# EAGLE design ETAG_v9.3b_EM4095 (EAGLE 7.5.0)

## Sheet 1 of 2
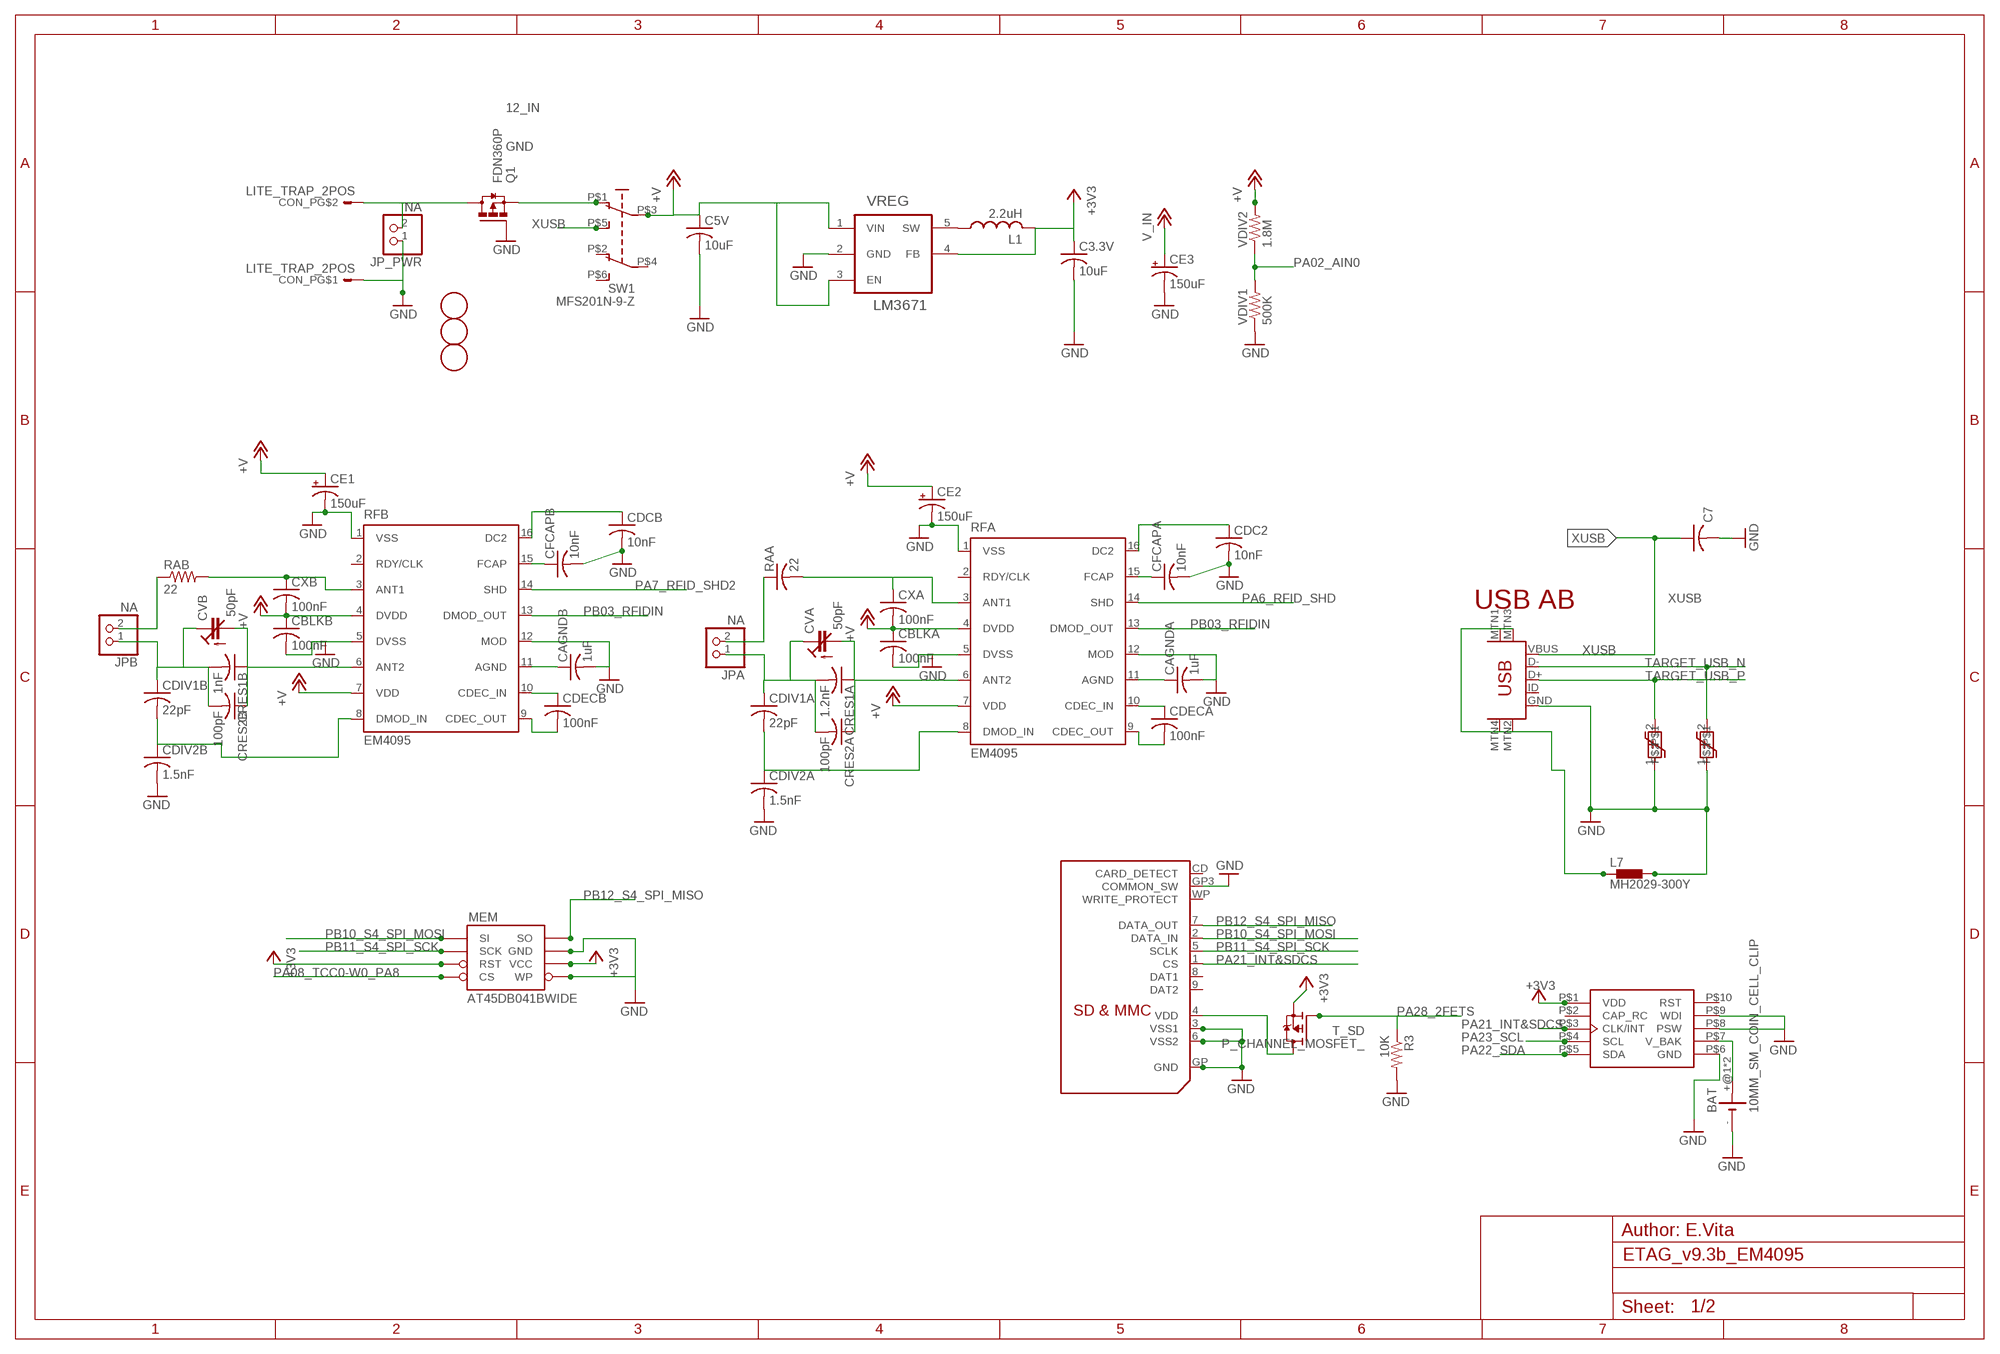
[diagram p0: schematic, sheet 1]

### Parts
BAT  10MM_SM_COIN_CELL_CLIP  [10MM_SM_COIN_CELL_CLIP]
C3.3V  10uF  C-USC0805  [C0805]
C5V  10uF  C-USC0805  [C0805]
C7  10nF  C-USROUND  [C0603-ROUND]
CAGNDA  1uF  C-US  [C0603-ROUND]
CAGNDB  1uF  C-US  [C0603-ROUND]
CBLKA  100nF  C-US  [C0603-ROUND]
CBLKB  100nF  C-US  [C0603-ROUND]
CDC2  10nF  C-US  [C0603-ROUND]
CDCB  10nF  C-USROUND  [C0603-ROUND]
CDECA  100nF  C-US  [C0603-ROUND]
CDECB  100nF  C-US  [C0603-ROUND]
CDIV1A  22pF  C-US  [C0603-ROUND]
CDIV1B  22pF  C-US  [C0603-ROUND]
CDIV2A  1.5nF  C-USROUND  [C0603-ROUND]
CDIV2B  1.5nF  C-US  [C0603-ROUND]
CE1  150uF  CPOL-USE2-5  [E2-5]
CE2  150uF  CPOL-USE2-5  [E2-5]
CE3  150uF  CPOL-USE2-5  [E2-5]
CFCAPA  10nF  C-USROUND  [C0603-ROUND]
CFCAPB  10nF  C-US  [C0603-ROUND]
CON_P  LITE_TRAP_2POS  [LITE_TRAP_MINI]
CRES1A  1.2nF  C-USROUND  [C0603-ROUND]
CRES1B  1nF  C-US  [C0603-ROUND]
CRES2A  100pF  C-US  [C0603-ROUND]
CRES2B  100pF  C-US  [C0603-ROUND]
CVA  50pF  C-TRIMM3018_11  [CTRIM3018_11]
CVB  50pF  C-TRIMM3018_11  [CTRIM3018_11]
CXA  100nF  C-US  [C0603-ROUND]
CXB  100nF  C-US  [C0603-ROUND]
FD1  FIDUCIALMOUNT  [FIDUCIA-MOUNT]
FD2  FIDUCIALMOUNT  [FIDUCIA-MOUNT]
FD3  FIDUCIALMOUNT  [FIDUCIA-MOUNT]
JP_PWR  NA  PINHD-1X2  [1X02]
JPA  NA  PINHD-1X2  [1X02]
JPB  NA  PINHD-1X2  [1X02]
L1  2.2uH  L-US4X4  [SMT_COIL_INDUCTOR_4X4MM]
L7  MH2029-300Y  BLM15H0805  [C0805K]
MEM  AT45DB041BWIDE  [SO08WIDE]
Q1  FDN360P  [SUPER-SOT3]
R3  10K  R-US_ROUND  [C0603-ROUND]
RAA  22  C-USC0805  [C0805]
RAB  22  R-US_R0805  [R0805]
RFA  EM4095  [SO16]
RFB  EM4095  [SO16]
RTC  MC-RTC-RV-1805-C3-I2C  [MC-RTC-C3]
SD  SDMMC06132  [06132]
SW1  MFS201N-9-Z  [MFS201N-9-Z]
T_SD  P_CHANNEL_MOSFET_  [SOT23]
USB  USB-MINIB-5PIN  [USB-MINIB]
VDIV1  500K  R-US_ROUND  [C0603-ROUND]
VDIV2  1.8M  R-US_ROUND  [C0603-ROUND]
VREG  LM3671  LM3671_SWITCHING_REGSOT23  [SOT23-5L]
Z5  ESD_SUPRESSOR  [C0603-ROUND]
Z6  ESD_SUPRESSOR  [C0603-ROUND]

### Nets
2GND [gnd]: L7.1 USB.MTN1(MTN2) USB.MTN2(MTN3) USB.MTN3(MTN1) USB.MTN4
12_IN: CON_P.P$3 CON_P.P$4 JP_PWR.2 Q1.3(D)
+3V3: C3.3V.1 L1.P$2 MEM.3(RST) MEM.6(VCC) RTC.P$1(VDD) T_SD.2(S) VREG.4(FB) ; also sheet 2
CVB: CDIV1B.1 CRES1B.2 CRES2B.2 CVB.+(E) JPB.1
GND [gnd]: BAT.- C3.3V.2 C5V.2 C7.2 CAGNDA.2 CAGNDB.2 CBLKA.2 CBLKB.2 CDC2.2 CDCB.2 CDIV2A.2 CDIV2B.2 CE1.- CE2.- CE3.- CFCAPA.2 CFCAPB.2 CON_P.P$1 CON_P.P$2 JP_PWR.1 L7.2 MEM.5(WP) MEM.7(GND) Q1.1(G) R3.2 RFA.1(VSS) RFA.5(DVSS) RFA.12(MOD) RFB.1(VSS) RFB.5(DVSS) RFB.12(MOD) RTC.P$6(GND) RTC.P$8(PSW) RTC.P$9(WDI) SD.3(VSS1) SD.6(VSS2) SD.GP3(COMMON_SW) SD.GP(GND) USB.GND VDIV1.1 VREG.2(GND) Z5.1 Z6.1 ; also sheet 2
N$2: CFCAPB.1 RFB.15(FCAP)
N$3: CAGNDB.1 RFB.11(AGND)
N$4: CFCAPA.1 RFA.15(FCAP)
N$5: CAGNDA.1 RFA.11(AGND)
N$6: CDC2.1 RFA.16(DC2)
N$7: CRES1B.1 CRES2B.1 CVB.-(A) RFB.6(ANT2)
N$8: CDIV1B.2 CDIV2B.1 RFB.8(DMOD_IN)
N$9: CDCB.1 RFB.16(DC2)
N$11: CDECB.2 RFB.9(CDEC_OUT)
N$12: CRES1A.1 CRES2A.1 CVA.-(A) RFA.6(ANT2)
N$13: CDIV1A.2 CDIV2A.1 RFA.8(DMOD_IN)
N$14: CDIV1A.1 CRES1A.2 CRES2A.2 CVA.+(E) JPA.1
N$15: CDECB.1 RFB.10(CDEC_IN)
N$16: CXB.1 RAB.2 RFB.3(ANT1)
N$17: Q1.2(S) SW1.P$1(O)
N$18: CDECA.2 RFA.9(CDEC_OUT)
N$19: CDECA.1 RFA.10(CDEC_IN)
N$20: CXA.1 RAA.2 RFA.3(ANT1)
N$22: JPB.2 RAB.1
N$35: JPA.2 RAA.1
PA02_AIN0: VDIV1.2 VDIV2.1 ; also sheet 2
PA6_RFID_SHD: RFA.14(SHD) ; also sheet 2
PA7_RFID_SHD2: RFB.14(SHD) ; also sheet 2
PA08_TCC0-W0_PA8: MEM.4(CS) ; also sheet 2
PA21_INT&SDCS: RTC.P$3(CLK/INT) SD.1(CS) ; also sheet 2
PA22_SDA: RTC.P$5(SDA) ; also sheet 2
PA23_SCL: RTC.P$4(SCL) ; also sheet 2
PA28_2FETS: R3.1 T_SD.1(G) ; also sheet 2
PB03_RFIDIN: RFA.13(DMOD_OUT) RFB.13(DMOD_OUT) ; also sheet 2
PB10_S4_SPI_MOSI: MEM.1(SI) SD.2(DATA_IN) ; also sheet 2
PB11_S4_SPI_SCK: MEM.2(SCK) SD.5(SCLK) ; also sheet 2
PB12_S4_SPI_MISO: MEM.8(SO) SD.7(DATA_OUT) ; also sheet 2
SW: L1.P$1 VREG.5(SW)
TARGET_USB_N [USBpair]: USB.D- Z6.2 ; also sheet 2
TARGET_USB_P [USBpair]: USB.D+ Z5.2 ; also sheet 2
V_IN: C5V.1 CBLKA.1 CBLKB.1 CE1.+ CE2.+ CE3.+ CXA.2 CXB.2 RFA.4(DVDD) RFA.7(VDD) RFB.4(DVDD) RFB.7(VDD) SW1.P$3(P) VDIV2.2 VREG.1(VIN) VREG.3(EN) ; supply symbol labelled +V ; also sheet 2
VBAT1: BAT.+@1(+) BAT.+@2(+) RTC.P$7(V_BAK)
VDD: SD.4(VDD) T_SD.3(D)
XUSB [usbvcc]: C7.1 SW1.P$5(S) USB.VBUS
Unconnected: RFA.2(RDY/CLK) RFB.2(RDY/CLK) RTC.P$2(CAP_RC) RTC.P$10(RST) SD.8(DAT1) SD.9(DAT2) SD.CD(CARD_DETECT) SD.WP(WRITE_PROTECT) SW1.P$2(O1) SW1.P$4(P1) SW1.P$6(S1) USB.ID

### Notes on the sheet
- USB AB
- Author: E.Vita

## Sheet 2 of 2
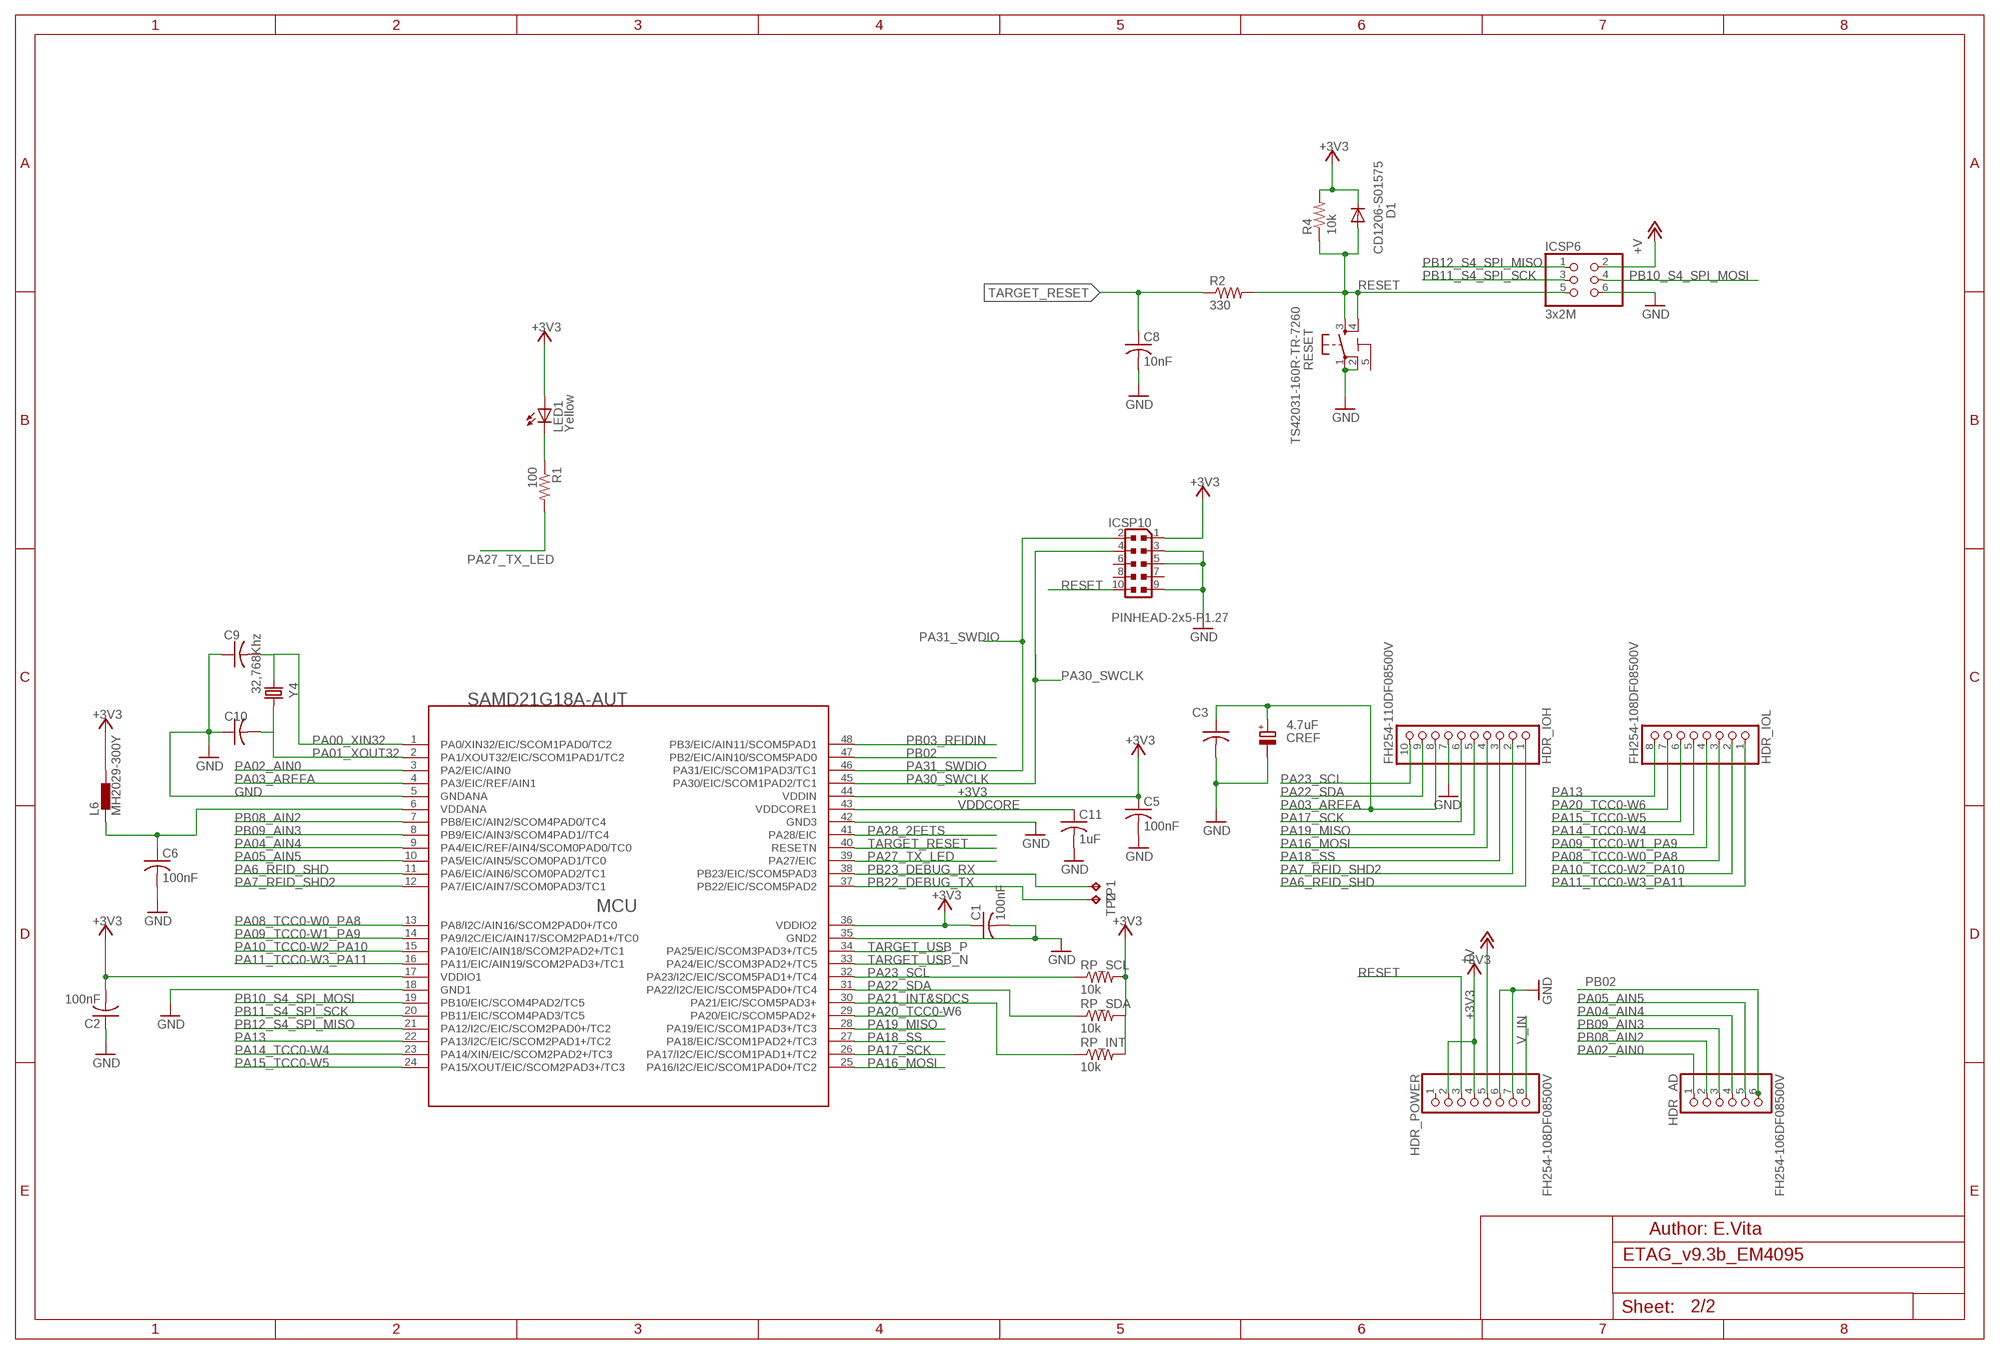
[diagram p1: schematic, sheet 2]

### Parts
C1  100nF  C-USROUND  [C0603-ROUND]
C2  100nF  C-USROUND  [C0603-ROUND]
C3  100nF  C-USROUND  [C0603-ROUND]
C5  100nF  C-USROUND  [C0603-ROUND]
C6  100nF  C-USROUND  [C0603-ROUND]
C8  10nF  C-USROUND  [C0603-ROUND]
C9  22pF  C-USROUND  [C0603-ROUND]
C10  22pF  C-USROUND  [C0603-ROUND]
C11  1uF  C-USROUND  [C0603-ROUND]
CREF  4.7uF  0474_TAJA475M016RNJ  [SMC_A]
D1  CD1206-S01575  0012_CD1206-S01575  [MINIMELF]
HDR_AD  FH254-106DF08500V  1682_20TW-535_STD  [1X06]
HDR_IOH  FH254-110DF08500V  1684_20TW-537  [1X10]
HDR_IOL  FH254-108DF08500V  1683_20TW-536  [1X08]
HDR_POWER  FH254-108DF08500V  1683_20TW-536  [1X08]
ICSP6  3x2M  0114_PH254-203DF118A00V  [2X03]
ICSP10  PINHEAD-2x5-P1.27  0171_PH127-205DF055G00AROUND-PADS  [PINHEAD_2X05_127]
L6  MH2029-300Y  BLM15H0805  [C0805K]
LED1  Yellow  0044_KPT-2012YC  [CHIPLED_0805]
MCU  SAMD21G18A-AUT  1792_SAMD21G18A-AUT  [TQFP48-7X7]
R1  100  R-US_ROUND  [C0603-ROUND]
R2  330  R-US_ROUND  [C0603-ROUND]
R4  10k  R-US_ROUND  [C0603-ROUND]
RESET  TS42031-160R-TR-7260  0946_TS42031-160W-TR-7260  [TS42]
RP_INT  10k  R-US_ROUND  [C0603-ROUND]
RP_SCL  10k  R-US_ROUND  [C0603-ROUND]
RP_SDA  10k  R-US_ROUND  [C0603-ROUND]
TP1  TPTP15R  [TP15R]
TP2  TPTP15R  [TP15R]
Y4  32,768Khz  0213_ABS07-32.768KHZ-T  [RESONATOR_EPSON_FC_145]

### Nets
+3V3: C1.1 C2.2 C5.1 D1.C HDR_POWER.2 HDR_POWER.4 ICSP10.1 L6.2 LED1.A MCU.17(VDDIO1) MCU.36(VDDIO2) MCU.44(VDDIN) R4.2 RP_INT.2 RP_SCL.2 RP_SDA.2 ; also sheet 1
GND [gnd]: C1.2 C2.1 C3.2 C5.2 C6.2 C8.2 C9.1 C10.1 C11.2 CREF.- HDR_IOH.7 HDR_POWER.6 HDR_POWER.7 ICSP6.6 ICSP10.3 ICSP10.5 ICSP10.9 MCU.5(GNDANA) MCU.18(GND1) MCU.35(GND2) MCU.42(GND3) RESET.1 RESET.2 ; also sheet 1
N$1: LED1.C R1.1
N$10: C6.1 L6.1 MCU.6(VDDANA)
PA00_XIN32: C9.2 MCU.1(PA0/XIN32/EIC/SCOM1PAD0/TC2) Y4.P$1
PA01_XOUT32: C10.2 MCU.2(PA1/XOUT32/EIC/SCOM1PAD1/TC2) Y4.P$2
PA02_AIN0: HDR_AD.1 MCU.3(PA2/EIC/AIN0) ; also sheet 1
PA03_AREFA: C3.1 CREF.+ HDR_IOH.8 MCU.4(PA3/EIC/REF/AIN1)
PA04_AIN4: HDR_AD.4 MCU.9(PA4/EIC/REF/AIN4/SCOM0PAD0/TC0)
PA05_AIN5: HDR_AD.5 MCU.10(PA5/EIC/AIN5/SCOM0PAD1/TC0)
PA6_RFID_SHD: HDR_IOH.1 MCU.11(PA6/EIC/AIN6/SCOM0PAD2/TC1) ; also sheet 1
PA7_RFID_SHD2: HDR_IOH.2 MCU.12(PA7/EIC/AIN7/SCOM0PAD3/TC1) ; also sheet 1
PA08_TCC0-W0_PA8: HDR_IOL.3 MCU.13(PA8/I2C/AIN16/SCOM2PAD0+/TC0) ; also sheet 1
PA09_TCC0-W1_PA9: HDR_IOL.4 MCU.14(PA9/I2C/EIC/AIN17/SCOM2PAD1+/TC0)
PA10_TCC0-W2_PA10: HDR_IOL.2 MCU.15(PA10/EIC/AIN18/SCOM2PAD2+/TC1)
PA11_TCC0-W3_PA11: HDR_IOL.1 MCU.16(PA11/EIC/AIN19/SCOM2PAD3+/TC1)
PA13: HDR_IOL.8 MCU.22(PA13/I2C/EIC/SCOM2PAD1+/TC2)
PA14_TCC0-W4: HDR_IOL.5 MCU.23(PA14/XIN/EIC/SCOM2PAD2+/TC3)
PA15_TCC0-W5: HDR_IOL.6 MCU.24(PA15/XOUT/EIC/SCOM2PAD3+/TC3)
PA16_MOSI: HDR_IOH.4 MCU.25(PA16/I2C/EIC/SCOM1PAD0+/TC2)
PA17_SCK: HDR_IOH.6 MCU.26(PA17/I2C/EIC/SCOM1PAD1+/TC2)
PA18_SS: HDR_IOH.3 MCU.27(PA18/EIC/SCOM1PAD2+/TC3)
PA19_MISO: HDR_IOH.5 MCU.28(PA19/EIC/SCOM1PAD3+/TC3)
PA20_TCC0-W6: HDR_IOL.7 MCU.29(PA20/EIC/SCOM5PAD2+)
PA21_INT&SDCS: MCU.30(PA21/EIC/SCOM5PAD3+) RP_INT.1 ; also sheet 1
PA22_SDA: HDR_IOH.9 MCU.31(PA22/I2C/EIC/SCOM5PAD0+/TC4) RP_SDA.1 ; also sheet 1
PA23_SCL: HDR_IOH.10 MCU.32(PA23/I2C/EIC/SCOM5PAD1+/TC4) RP_SCL.1 ; also sheet 1
PA27_TX_LED: MCU.39(PA27/EIC) R1.2
PA28_2FETS: MCU.41(PA28/EIC) ; also sheet 1
PA30_SWCLK: ICSP10.4 MCU.45(PA30/EIC/SCOM1PAD2/TC1)
PA31_SWDIO: ICSP10.2 MCU.46(PA31/EIC/SCOM1PAD3/TC1)
PB02: HDR_AD.6 MCU.47(PB2/EIC/AIN10/SCOM5PAD0)
PB03_RFIDIN: MCU.48(PB3/EIC/AIN11/SCOM5PAD1) ; also sheet 1
PB08_AIN2: HDR_AD.2 MCU.7(PB8/EIC/AIN2/SCOM4PAD0/TC4)
PB09_AIN3: HDR_AD.3 MCU.8(PB9/EIC/AIN3/SCOM4PAD1//TC4)
PB10_S4_SPI_MOSI: ICSP6.4 MCU.19(PB10/EIC/SCOM4PAD2/TC5) ; also sheet 1
PB11_S4_SPI_SCK: ICSP6.3 MCU.20(PB11/EIC/SCOM4PAD3/TC5) ; also sheet 1
PB12_S4_SPI_MISO: ICSP6.1 MCU.21(PA12/I2C/EIC/SCOM2PAD0+/TC2) ; also sheet 1
PB22_DEBUG_TX: MCU.37(PB22/EIC/SCOM5PAD2) TP2.TP
PB23_DEBUG_RX: MCU.38(PB23/EIC/SCOM5PAD3) TP1.TP
RESET: D1.A HDR_POWER.3 ICSP6.5 ICSP10.10 R2.2 R4.1 RESET.3 RESET.4
TARGET_RESET: C8.1 MCU.40(RESETN) R2.1
TARGET_USB_N [USBpair]: MCU.33(PA24/EIC/SCOM3PAD2+/TC5) ; also sheet 1
TARGET_USB_P [USBpair]: MCU.34(PA25/EIC/SCOM3PAD3+/TC5) ; also sheet 1
V_IN: HDR_POWER.5 HDR_POWER.8 ICSP6.2 ; supply symbol labelled +V ; also sheet 1
VDDCORE: C11.1 MCU.43(VDDCORE1)
Unconnected: HDR_POWER.1 ICSP10.6 ICSP10.7 ICSP10.8

### Notes on the sheet
- Author: E.Vita

## Power pins joined to a net without a drawn wire
5-GND: RESET.5(5-GND)

## Library data of the parts
BAT = battery:10MM_SM_COIN_CELL_CLIP: Battery cell clip for CR927 Source: KEYSTONE ELECTRONICS CORP. www.keyelco.com, ASTORIA, N.Y. 11105-2017 PART ANME 10mm SM COIN CELl CLIP DWG NO. 3030
C1-C3 C3.3V C5 C5V C6-C11 CAGNDA CAGNDB CBLKA CBLKB CDC2 CDCB CDECA CDECB CDIV1A CDIV1B CDIV2A CDIV2B CFCAPA CFCAPB CRES1A CRES1B CRES2A CRES2B CXA CXB RAA = rcl:C-US: CAPACITOR, American symbol
CE1-CE3 = rcl:CPOL-US: POLARIZED CAPACITOR, American symbol
CON_P = con-molex:LITE_TRAP_2POS
CREF = Condensatori:0474_TAJA475M016RNJ: 4u7 tantalio Case A - testa gialla -Tantalio; CASE: CaseA_(1206); MONTHLY_USAGE: _____; PART_NUMBER: TAJA475M016RNJ; PRICE: _____; SUPPLIER: _____; TYPE: Condensatori; VALUE: 4u7
CVA CVB = rcl:C-TRIMM: Trimm capacitor
D1 = Diodi:0012_CD1206-S01575: small-signal high-speed Switching Diodes CD1206; CASE: 1206; MONTHLY_USAGE: _____; PART_NUMBER: CD1206-S01575; PRICE: _____; SUPPLIER: _____; TYPE: Diodi
FD1-FD3 = SmartPrj:FIDUCIALMOUNT
HDR_AD = Connettori:1682_20TW-535: Female Gray Connector strip for Arduino 3V3 bases - 6x1 F V h 8,5 p2,54; MONTHLY_USAGE: 86722.85; PART_NUMBER: 20TW-535; PRICE: _0.03; SUPPLIER: CBC_elettronica__s.r.l.; TYPE: Connettori
HDR_IOH = Connettori:1684_20TW-537: Female Gray Connector strip for Arduino 3V3 bases - 10x1 F V h 8,5 p2,54mm; MONTHLY_USAGE: _____; PART_NUMBER: 20TW-537; PRICE: _____; SUPPLIER: _____; TYPE: Connettori
HDR_IOL HDR_POWER = Connettori:1683_20TW-536: Female Gray Connector strip for Arduino 3V3 bases - 8x1 F V h 8,5 p2,54mm; MONTHLY_USAGE: _____; PART_NUMBER: 20TW-536; PRICE: _____; SUPPLIER: _____; TYPE: Connettori
ICSP6 = Connettori:0114_PH254-203DF118A00V: 3x2 M V h 8,5 mm p2,54; MONTHLY_USAGE: _____; PART_NUMBER: PH254-203DF118A00V; PRICE: _____; SUPPLIER: _____; TYPE: Connettori; VALUE: ICSP
ICSP10 = Connettori:0171_PH127-205DF055G00A: 2x5 PASSO 1,27
JP_PWR JPA JPB = pinhead:PINHD-1X2: PIN HEADER
L1 = rcl:L-US: INDUCTOR, American symbol
L6 L7 = inductors:BLM15H: EMIFIL (R) Chip Ferrite Bead for GHz Noise Source: http://www.murata.com/ Ferrite Bead BLM15H.pdf
LED1 = Opto:0044_KPT-2012YC: LED YELLOW - SMD - 0805; MONTHLY_USAGE: _____; PART_NUMBER: KPT-2012YC; PRICE: _____; SUPPLIER: _____; TYPE: Opto
MCU = IntegratedCircuits:1792_SAMD21G18A-AUT: Atmel D21 32bit ARM Cortex-M0 microcontroller - 48 PIN TQFP 256KB flash memory + 32KB SRAM
MEM = SparkFun-DigitalIC:AT45DB041B: 4-Mbit SPI flash memory
Q1 = transistor-power:FDN360P: Single P-Channel, PowerTrench (R) MOSFET Source: http://www.fairchildsemi.com/ds/FD/FDN360P.pdf
R1-R4 RAB RP_INT RP_SCL RP_SDA VDIV1 VDIV2 = rcl:R-US_: RESISTOR, American symbol
RESET = Switches:0946_TS42031-160W-TR-7260: Pushbutton 6x6 Smd - White; MONTHLY_USAGE: _____; PART_NUMBER: IT-1157AHNP-160G-G_GTR; PRICE: _____; SUPPLIER: _____; TYPE: Switches; VALUE: TS42
RFA RFB = em-microelectronic:EM4095: Read/Write analog front end for 125kHz RFID Basestation Source: http://www.emmicroelectronic.com/webfiles/Product/RFID/DS/EM4095_DS.pdf
RTC = Microcrystal-RTC:MC-RTC-RV-1805-C3-I2C: MicroCrystal RV-1805-C3 Extreme Low Power RTC Module Extreme Low Current consumption XTAL-Mode 60nA RC-Mode 17nA RC Autocalibrated Mode 22nA Factory calibrated Time accuracy typ. ±2.0ppm @ 25°C Miniature SMT ceramic package with integrated Quartz Crystal for best Noise & EMI Immunity Automatic Battery Switchover, Trickle Charger, Power Management & Power Switch Function Programmable CLKOUT frequencies I2C Bus Interface (fast mode 400kHz) Time keeping mode down to 1.5 V Programmable Alarm, Timer and INT 512 Bytes of User RAM
SD = microbuilder:SDMMC: SD MMC Card holder 4UCON part #06132 - easy to solder
SW1 = switch:MFS201N-9-Z
T_SD = transistor-fet:P_CHANNEL_MOSFET_
TP1 TP2 = testpad:TP: Test pad
USB = USB_miniB:USB-MINIB
VREG = Texas Instruments:LM3671_SWITCHING_REG
Y4 = Cristalli:0213_ABS07-32.768KHZ-T: 32,768KHz - SMD; MONTHLY_USAGE: _____; PART_NUMBER: ABS07-32.768KHZ-T; PRICE: _____; SUPPLIER: _____; TYPE: Cristalli; VALUE: 32,768Khz_SMD
Z5 Z6 = diode:ESD_SUPRESSOR

## Net classes
1 USB: width 0.203 mm, drill 0.305 mm, clearance 0.178 mm
2 gnd: width 0.254 mm, drill 0.254 mm, clearance 0.178 mm
3 usbvcc: width 0.203 mm, drill 0.406 mm, clearance 0.178 mm
4 USBpair: width 0.254 mm, drill 0.406 mm, clearance 0.406 mm

## Board
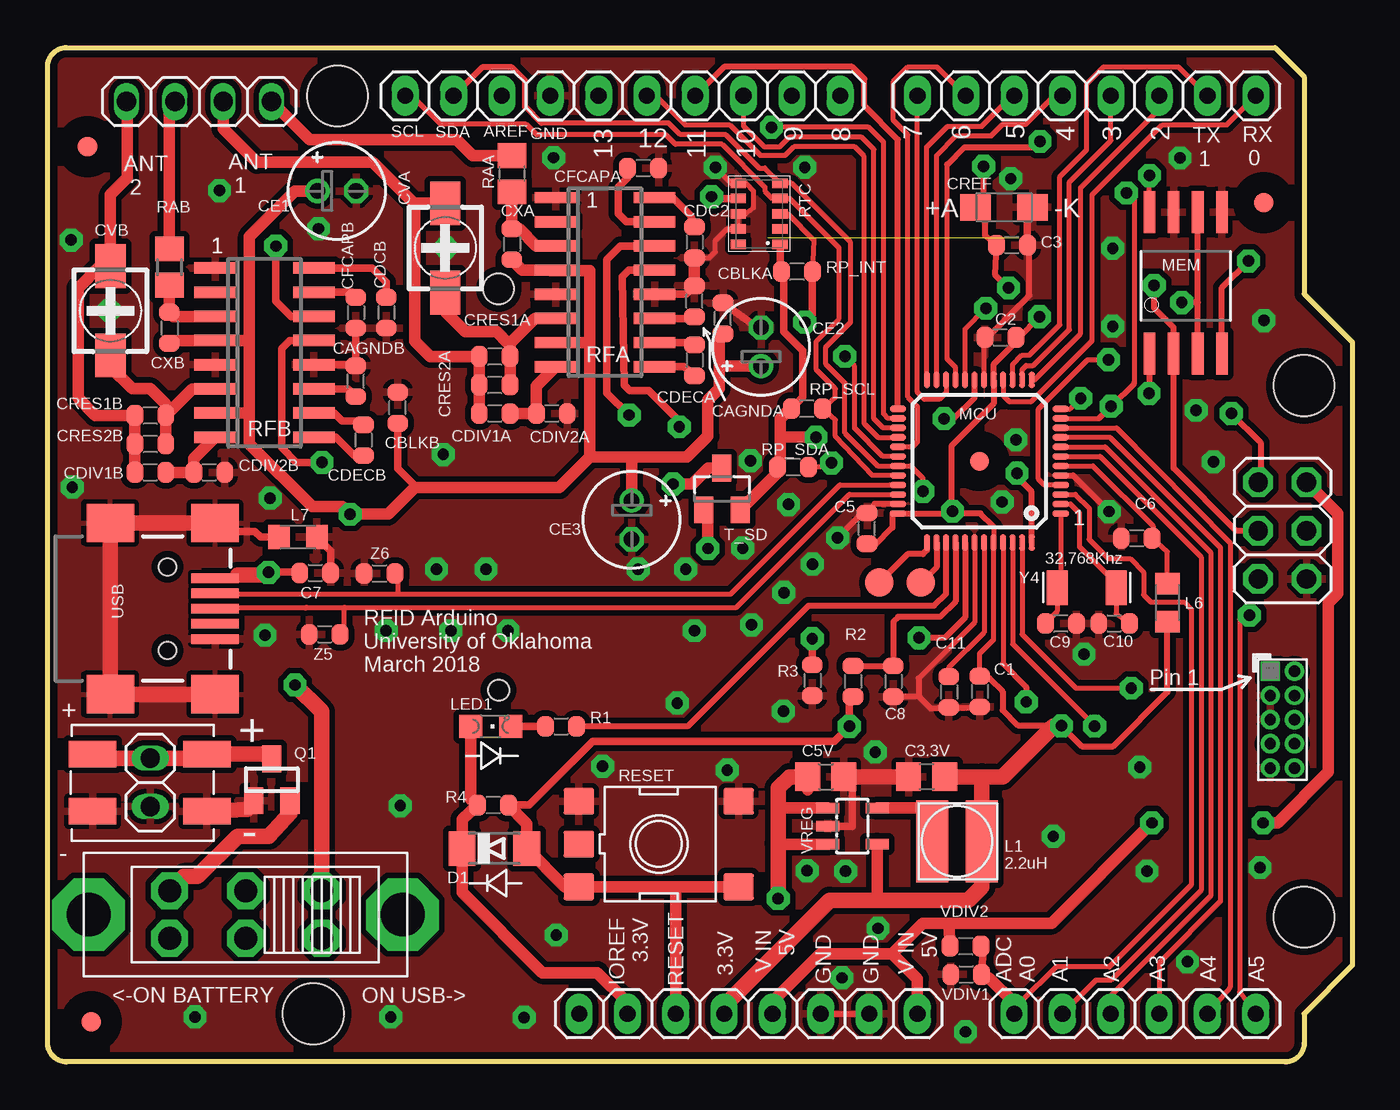
[diagram p2: board, top side]
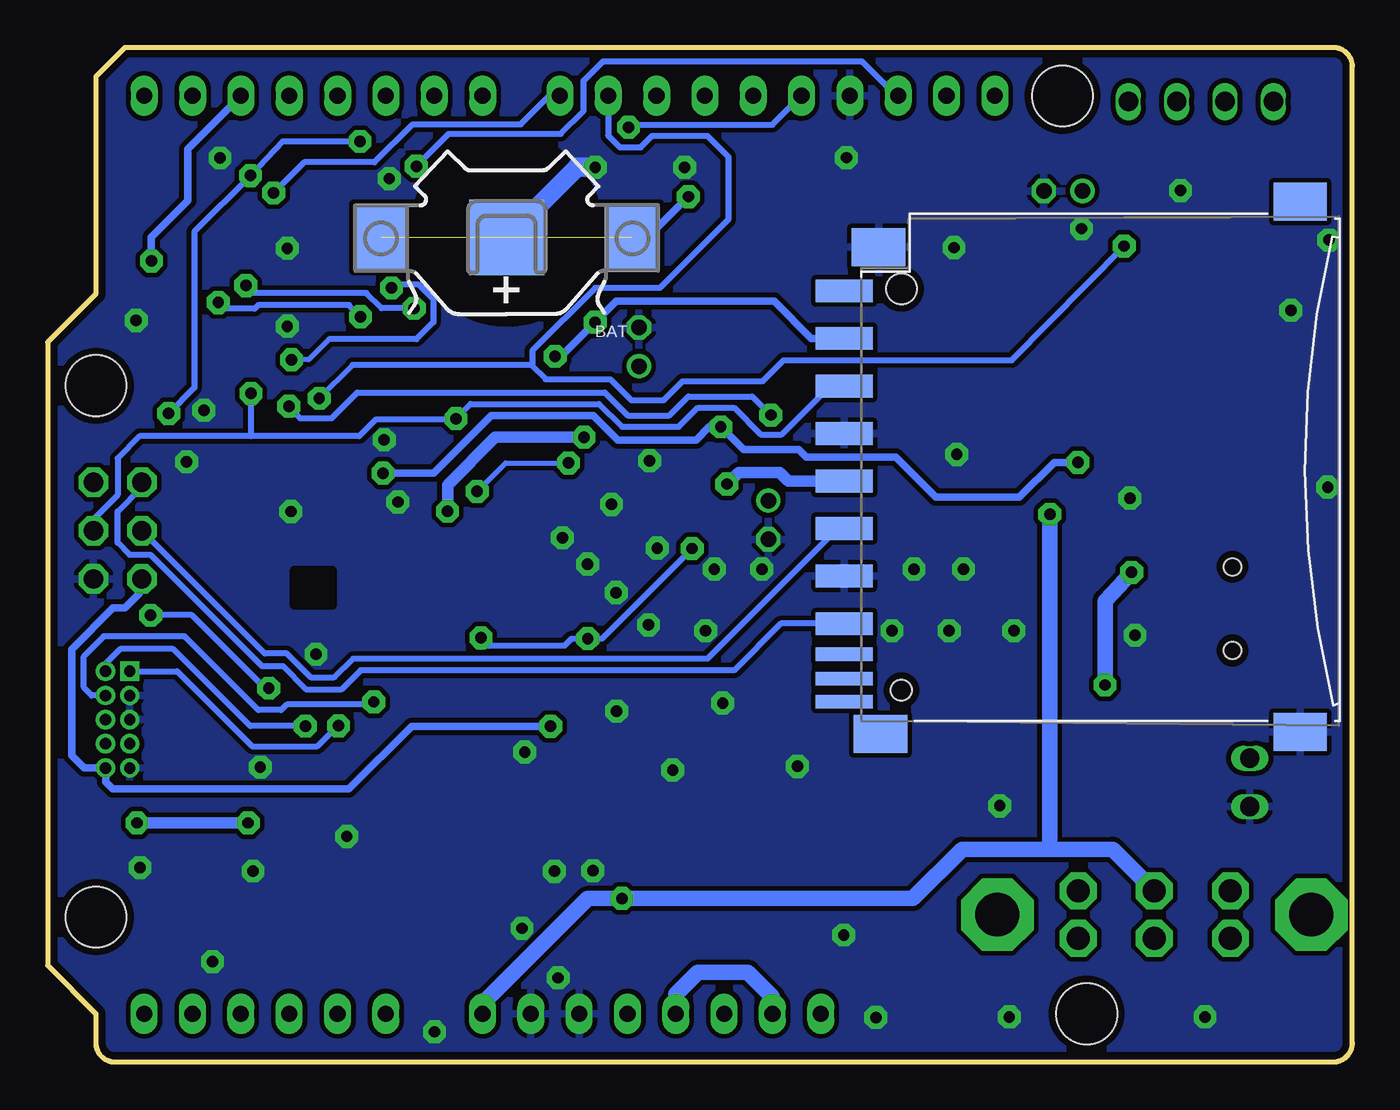
[diagram p3: board, bottom side, seen from below]

Size 68.58 x 53.34 mm. Coordinates in mm from the lower left corner, seen from the top.
Outline: 64.52,53.34 66.04,51.82 66.04,40.39 68.58,37.85 68.58,5.08 66.04,2.54 66.04,1 arc-90 65.04,0 1,0 arc-90 0,1 0,52.34 arc-90 1,53.34 64.52,53.34
Copper layers (1*2+15*16): Top 0.035mm / dielectric 0.5mm / layer 2 0.035mm / dielectric 0.4mm / layer 15 0.035mm / dielectric 0.5mm / Bottom 0.035mm
Design rules "ArduinoUno *": minimum track width 6mil, minimum drill 16mil, track to track 6mil, track to pad 6mil, pad to pad 4mil, via to via 6mil, smd to smd 4mil, copper to edge 15mil, drill to drill 10mil, minimum pad ring 6mil, minimum via ring 4.5mil, stop-mask expansion 1mil, vias tented up to drill 32mil, thermal gap 10mil
Holes 3.2 mm at 66.04,35.56 66.04,7.62 15.24,50.8 13.97,2.54
bRestrict: area 41.7,41 to 47.2,46.5
vRestrict: area 42.2,47.2 to 43.3,48.8; area 48.3,47.5 to 49.5,48.9; area 47.6,47.4 to 48.8,48.9; area 50.2,47.4 to 51.3,48.9; area 44.7,47.2 to 45.8,48.8

### Footprints (pad centres in the part's own frame; a part is rotated, then mirrored left to right if it is on the bottom)
10MM_SM_COIN_CELL_CLIP = smd 2.9 x 3.5: +@1 -6.6,0; +@2 6.6,0 | smd 3.96 x 3.96: - 0,0
C0603-ROUND = smd 0.898 x 1.1: 1 -0.813,0; 2 0.813,0
C0805 = smd 1.3 x 1.5: 1 -0.95,0; 2 0.95,0
E2-5 = drill 0.813 pad 1.27: + -1.016,0 | drill 0.813 pad 1.27 octagon: - 1.016,0
LITE_TRAP_MINI = smd 2.5 x 1.4: P$1 -3,1.5; P$2 3,1.5; P$3 -3,-1.5; P$4 3,-1.5
SMC_A = smd 1.6 x 1.4: + -1.5,0; - 1.5,0
CTRIM3018_11 = smd 2.3 x 1.6: + -2.35,0; - 2.35,0
MINIMELF = smd 1.4 x 1.8: A 1.7,0; C -1.7,0
FIDUCIA-MOUNT = smd 1.016 x 1.016: P$1 0,0
1X06 = drill 0.85 pad 1.422 long: 1 -6.35,0; 2 -3.81,0; 3 -1.27,0; 4 1.27,0; 5 3.81,0; 6 6.35,0
1X10 = drill 0.85 pad 1.422 long: 1 -11.43,0; 2 -8.89,0; 3 -6.35,0; 4 -3.81,0; 5 -1.27,0; 6 1.27,0; 7 3.81,0; 8 6.35,0; 9 8.89,0; 10 11.43,0
1X08 = drill 0.85 pad 1.422 long: 1 -8.89,0; 2 -6.35,0; 3 -3.81,0; 4 -1.27,0; 5 1.27,0; 6 3.81,0; 7 6.35,0; 8 8.89,0
2X03 = drill 1.016 pad 1.55 octagon: 1 -2.54,-1.27; 2 -2.54,1.27; 3 0,-1.27; 4 0,1.27; 5 2.54,-1.27; 6 2.54,1.27
PINHEAD_2X05_127 = drill 0.6 pad 1.016 square: 1 -0.635,2.54 | drill 0.6 pad 1.016: 2 0.635,2.54; 3 -0.635,1.27; 4 0.635,1.27; 5 -0.635,0; 6 0.635,0; 7 -0.635,-1.27; 8 0.635,-1.27; 9 -0.635,-2.54; 10 0.635,-2.54
1X02 = drill 1.016 long: 1 -1.27,0; 2 1.27,0
SMT_COIL_INDUCTOR_4X4MM = smd 1.7 x 4.3: P$1 -1.3,0; P$2 1.3,0
C0805K = smd 1.143 x 1.27: 1 -1,0; 2 1,0
CHIPLED_0805 = smd 1.2 x 1.2: A 0,-1.05; C 0,1.05
TQFP48-7X7 = smd 0.85 x 0.32: 1 -4.275,2.75; 2 -4.275,2.25; 3 -4.275,1.75; 4 -4.275,1.25; 5 -4.275,0.75; 6 -4.275,0.25; 7 -4.275,-0.25; 8 -4.275,-0.75; 9 -4.275,-1.25; 10 -4.275,-1.75; 11 -4.275,-2.25; 12 -4.275,-2.75; 25 4.275,-2.75; 26 4.275,-2.25; 27 4.275,-1.75; 28 4.275,-1.25; 29 4.275,-0.75; 30 4.275,-0.25; 31 4.275,0.25; 32 4.275,0.75; 33 4.275,1.25; 34 4.275,1.75; 35 4.275,2.25; 36 4.275,2.75 | smd 0.32 x 0.85: 13 -2.75,-4.275; 14 -2.25,-4.275; 15 -1.75,-4.275; 16 -1.25,-4.275; 17 -0.75,-4.275; 18 -0.25,-4.275; 19 0.25,-4.275; 20 0.75,-4.275; 21 1.25,-4.275; 22 1.75,-4.275; 23 2.25,-4.275; 24 2.75,-4.275; 37 2.75,4.275; 38 2.25,4.275; 39 1.75,4.275; 40 1.25,4.275; 41 0.75,4.275; 42 0.25,4.275; 43 -0.25,4.275; 44 -0.75,4.275; 45 -1.25,4.275; 46 -1.75,4.275; 47 -2.25,4.275; 48 -2.75,4.275 | smd 1 x 1: P$1 0,0
SO08WIDE = smd 0.61 x 2.21: 1 -1.905,-3.569; 2 -0.635,-3.569; 3 0.635,-3.569; 4 1.905,-3.569; 5 1.905,3.886; 6 0.635,3.886; 7 -0.635,3.886; 8 -1.905,3.886
SUPER-SOT3 = smd 1 x 1.4: 1 -0.95,-1.1; 2 0.95,-1.1; 3 0,1.1
R0805 = smd 1.3 x 1.5: 1 -0.95,0; 2 0.95,0
TS42 = smd 1.6 x 1.4: 1 -4.2,2.25; 2 4.2,2.25; 3 -4.2,-2.25; 4 4.2,-2.25; 5 -4.2,0
SO16 = smd 0.6 x 2.2: 1 -4.445,-2.6; 2 -3.175,-2.6; 3 -1.905,-2.6; 4 -0.635,-2.6; 5 0.635,-2.6; 6 1.905,-2.6; 7 3.175,-2.6; 8 4.445,-2.6; 9 4.445,2.6; 10 3.175,2.6; 11 1.905,2.6; 12 0.635,2.6; 13 -0.635,2.6; 14 -1.905,2.6; 15 -3.175,2.6; 16 -4.445,2.6
MC-RTC-C3 = smd 0.5 x 0.8: P$1 -1.6,-1.1; P$2 -0.8,-1.1; P$3 0,-1.1; P$4 0.8,-1.1; P$5 1.6,-1.1; P$6 1.6,1.1; P$7 0.8,1.1; P$8 0,1.1; P$9 -0.8,1.1; P$10 -1.6,1.1
06132 = smd 1.2 x 3: 1 6.9,0.9; 2 4.4,0.9; 3 1.9,0.9; 4 -0.6,0.9; 5 -3.1,0.9; 6 -5.6,0.9; 7 -8.1,0.9; 9 9.4,0.9 | smd 0.7 x 3: 8 -9.7,0.9; CD -11,0.9; WP -12.2,0.9 | smd 2 x 2.8: GP -13.8,-23.07; GP2 14.1,-23.07; GP3 11.7,-0.9; GP4 -13.9,-1 | hole 1.1: -11.6,-2.1 | hole 1.6: 9.5,-2.1
MFS201N-9-Z = drill 1.2 pad 1.93 octagon: P$1 -4,1.25; P$2 -4,-1.25; P$3 0,1.25; P$4 0,-1.25; P$5 4,1.25; P$6 4,-1.25 | drill 2.3 pad 3.81 octagon: P$7 -8.25,0; P$8 8.25,0
SOT23 = smd 1 x 1.4: 1 -0.95,-1.1; 2 0.95,-1.1; 3 0,1.1
TP15R = smd 1.5 x 1.5: TP 0,0
USB-MINIB = smd 2.5 x 0.5: D+ 2.5,0; D- 2.5,0.8; GND 2.5,-1.6; ID 2.5,-0.8; VBUS 2.5,1.6 | smd 2.5 x 2: MTN1 -3,4.5; MTN2 2.5,4.5; MTN3 -3,-4.5; MTN4 2.5,-4.5 | hole 0.9: 0,2.2; 0,-2.2
SOT23-5L = smd 0.55 x 1.2: 1 -0.95,-1.3; 2 0,-1.3; 3 0.95,-1.3; 4 0.95,1.3; 5 -0.95,1.3
RESONATOR_EPSON_FC_145 = smd 1.1 x 1.8: P$1 -1.55,0; P$2 1.55,0

### Placement (x,y rotation side)
BAT  44.45,43.35 180 bottom
C1  48.99,19.48 270 top
C2  50.07,38.1 0 top
C3  50.68,42.95 0 top
C3.3V  46.2,15 180 top
C5  43.07,28.05 90 top
C5V  40.9,15 0 top
C6  57.24,27.54 180 top
C7  14.07,25.71 0 top
C8  44.45,20.01 270 top
C9  53.26,23.06 180 top
C10  56.06,23.06 0 top
C11  47.37,19.46 270 top
CAGNDA  34,40 90 top
CAGNDB  16.2,35.8 90 top
CBLKA  35.5,39.1 90 top
CBLKB  18.4,34.4 90 top
CDC2  34,43.1 270 top
CDCB  17.8,39.4 270 top
CDECA  34,36.9 270 top
CDECB  16.6,32.7 270 top
CDIV1A  23.5,34.1 0 top
CDIV1B  5.4,31 0 top
CDIV2A  26.5,34.1 0 top
CDIV2B  8.5,31 0 top
CE1  15.2,45.8 0 top
CE2  37.5,37.6 90 top
CE3  30.7,28.5 270 top
CFCAPA  31.3,47 0 top
CFCAPB  16.2,39.4 270 top
CON_P  5.37,14.69 180 top
CREF  50.27,44.94 0 top
CRES1A  23.5,37.1 180 top
CRES1B  5.4,34 180 top
CRES2A  23.5,35.6 180 top
CRES2B  5.4,32.5 180 top
CVA  20.9,42.8 270 top
CVB  3.3,39.5 270 top
CXA  24.4,43 270 top
CXB  6.4,38.6 270 top
D1  23.48,11.22 0 top
FD1  2.1,48.13 180 top
FD2  2.31,2.13 0 top
FD3  63.92,45.19 0 top
HDR_AD  57.15,2.54 0 top
HDR_IOH  30.23,50.8 180 top
HDR_IOL  54.61,50.8 180 top
HDR_POWER  36.83,2.54 0 top
ICSP6  64.9,27.94 270 top
ICSP10  64.9,18 0 top
JP_PWR  5.4,14.7 90 top
JPA  10.5,50.5 0 top
JPB  5.42,50.5 0 top
L1  47.8,11.6 0 top
L6  58.86,24.15 270 top
L7  13.16,27.6 0 top
LED1  23.29,17.65 270 top
MCU  48.97,31.59 180 top
MEM  59.82,40.81 0 top
Q1  11.79,14.84 0 top
R1  26.99,17.64 0 top
R2  42.33,20.01 270 top
R3  40.19,20.06 270 top
R4  23.41,13.51 180 top
RAA  24.4,46.7 270 top
RAB  6.4,41.8 270 top
RESET  32.12,11.46 0 top
RFA  29.3,41 270 top
RFB  11.4,37.3 270 top
RP_INT  39.39,41.56 180 top
RP_SCL  39.91,34.35 180 top
RP_SDA  39.19,31.28 180 top
RTC  37.4,44.6 90 top
SD  25.81,31.15 90 bottom
SW1  10.41,7.75 0 top
T_SD  35.44,30.13 0 top
TP1  45.9,25.2 0 top
TP2  43.7,25.2 0 top
USB  6.3,23.84 0 top
VDIV1  48.28,4.6 0 top
VDIV2  48.25,6.09 180 top
VREG  42.3,12.4 270 top
Y4  54.61,24.94 0 top
Z5  14.56,22.48 0 top
Z6  17.45,25.68 0 top

### Tracks (layer width: path | path; a pad name or v marks a point on that pad's centre or on a via)
2GND
  Top 0.406: L7.1 11.21,27.59 10.9,27.9 9.24,27.9 USB.MTN2
  Top 0.813: USB.MTN4 9.11,19.27 8.97,19.27 8.9,19.34 USB.MTN3 USB.MTN1 USB.MTN2
  pour Top: 1.86,29.78 10.49,29.78 10.49,26.76 7.96,26.76 7.96,20.79 10.49,20.79 10.49,17.87 1.86,17.87
12_IN
  Top 0.813: Q1.3 11.35,16.19 CON_P.P$3 8.16,15.97 JP_PWR.2 2.59,15.97 CON_P.P$4
+3V3  (via drill 0.6)
  Top 0.127: 49.71,27.33 MCU.44
  Top 0.254: 49.72,28.15 MCU.44 49.72,22.21 48.99,21.48 C1.1 49.5,20.17 | 49.72,36.18 49.73,36.19 | 43.03,26.99 C5.1
  Top 0.305: 49.72,36.18 MCU.17 49.72,34.61 47.5,32.38 47.5,29.02 v47.56,28.96 | 49.73,36.19 49.73,36.7 50.96,37.93 C2.2 51.04,38.1 v52.13,39.19 | 49.72,28.15 49.03,28.84 47.67,28.84 v47.56,28.96 | 49.5,20.17 50.2,19.47 50.2,18.5 51,17.7 52.5,17.7 53.32,17.68 v53.29,17.68 54.37,16.6 56,16.6 58.86,19.46 L6.2 | C5.1 43.46,27.16 44.4,28.1 44.4,28.84 MCU.36 47.44,28.84 v47.56,28.96 | MEM.3 60.45,39.94 | 60.45,39.94 v59.61,39.94 | 60.45,39.94 MEM.6
  Top 0.406: 30.48,3.12 HDR_POWER.2 | RTC.P$1 38.5,42.2 RP_INT.2 38.7,41.36 38.7,38.4 39.7,37.4 39.7,34.95 RP_SCL.2
  Top 0.61: 30.48,3.12 28.9,4.7 26,4.7 21.78,8.92 D1.C 21.78,12.77 R4.2 22.24,13.79 LED1.A | 38.5,32.8 38.5,31.4 38.38,31.28 RP_SDA.2 38.37,31.01 T_SD.2 | 38.5,32.8 38.5,33.83 39.02,34.35 RP_SCL.2 | v40.39,32.85 38.55,32.85 38.5,32.8 | VREG.4 43.6,8.5 43.5,8.5
  Top 0.813: C3.3V.1 49.1,15 | 49.1,15 50.21,15 52.89,17.68 v53.29,17.68 | HDR_POWER.4 35.56,2.96 41.1,8.5 43.5,8.5 48.4,8.5 49.1,9.2 L1.P$2 49.1,15
  Bottom 0.305: ICSP10.1 61.77,20.54 57.83,16.6 54.4,16.6 53.32,17.68 v53.29,17.68 | v52.13,39.19 52.75,39.8 57.5,39.8 57.7,39.6 59.27,39.6 v59.61,39.94
  Bottom 0.61: v40.39,32.85 45.05,32.85 47.56,30.34 v47.56,28.96
  Bottom 0.813: HDR_POWER.4 35.56,3.56 34.4,4.72 31.77,4.72 30.48,3.43 HDR_POWER.2
CVB
  Top 0.61: CDIV1B.1 CRES2B.2 CRES1B.2 2.5,34 1.6,34.9 1.6,40.7 2.75,41.85 CVB.+ 3.3,45.6 4.2,46.5 4.2,50.45 JPB.1
GND  (via drill 0.6)
  Top 0.254: MCU.42 48.72,23.11 45.78,20.17 | C11.2 47.37,18.59 | MCU.18 49.22,38.03 C2.1 | CDC2.2 34.79,42.29 35.1,42.6 35.1,43.2 35.7,43.8 RTC.P$9 RTC.P$8 36.7,44.6 37.1,44.9 37.1,45.8 36.7,46.2 RTC.P$6 35.94,46.2 v35.1,47.05
  Top 0.305: HDR_POWER.6 HDR_POWER.7 | MCU.35 43.47,29.34 C5.2 42.9,28.94 v41.52,27.57 | MCU.5 53.89,30.84 v55.79,28.94 | C1.2 47.4,18.59 C11.2 46.44,18.57 45.78,19.22 | 45.78,20.17 45.78,19.22 | 45.78,19.22 C8.2 | 36.4,44.6 RTC.P$8 | C2.1 49.4,38.1 51.6,40.3 51.6,42.92 C3.2
  Top 0.406: 34,40.99 CAGNDA.2 33.58,40.37 RFA.12 | RFB.12 15.68,36.66 CAGNDB.2 CFCAPB.2 | 42.3,15 C5V.2 41.85,14.6 42.3,14.6 42.3,12.4 VREG.2 | CBLKA.2 37.2,38.69 CE2.- | C3.2 51.49,44.66 arc-90 CREF.- | L7.2 14.88,26.88 C7.2
  Top 0.61: CDC2.2 CAGNDA.2
  Top 0.813: CON_P.P$1 10.49,13.29 Q1.1 | 42.3,15 C3.3V.2
  Bottom 1.016: v39.8,47.05 40.75,47.05 BAT.-
  other vias: 29.18,15.55 63.72,10.22 52.86,11.86 20.44,25.92 59.91,5.27 1.3,30.22 11.43,22.44 41.95,10.03 48.24,1.59 38.67,18.44 33.1,18.87 35.72,15.36 57.78,10.03 57.4,15.5 7.75,2.37 18.04,2.37 25.05,2.35 63.92,38.99 60.37,34.26 59.52,47.54 54.47,21.44 50.17,29.44 50.89,32.72 50.62,46.45 11.7,29.65 20.8,31.95 24.2,22.67 17.8,22.67 21.2,22.67 34,22.67 33.54,25.92 23.04,25.92 40.2,26.18 38.7,24.68 37,22.98 41.75,4.43 31.04,25.92 20.94,42.82 3.24,39.52 43.5,16.3 61.27,31.56 36.54,27.02 1.24,43.22 9.04,45.82 14.24,43.82 26.74,6.67 26.6,47.55 38.94,29.32 55.98,38.69 55.98,42.79 36.94,31.62 39.92,10.05 43.65,7.03 18.54,13.47
  pour Bottom (isolate 0.254, rank 2): 0.2,53.2 64.4,53.2 66,51.6 66,40.3 68.5,37.8 68.6,5 66,2.4 66,0 0.2,0
  pour Top (isolate 0.305): 0.4,53 64.5,53 65.8,51.7 65.8,40.2 68.3,37.7 68.3,5.2 65.8,2.7 65.8,0.8 65.3,0.3 0.8,0.3 0.3,0.8 0.3,52.9 0.5,52.9
N$1
  Top 0.406: R1.1 26.09,17.65 LED1.C
N$2
  Top 0.406: RFB.15 16.01,40.48 CFCAPB.1
N$3
  Top 0.406: 14.02,35.41 RFB.11 15.79,35.4 CAGNDB.1
N$4
  Top 0.406: CFCAPA.1 30.49,46.49 30,46 30,44.6 30.43,44.17 RFA.15
N$5
  Top 0.406: RFA.11 33.78,39.09 CAGNDA.1
N$6
  Top 0.406: RFA.16 31.94,45.49 32.81,45.49 33.8,44.5 CDC2.1
N$7
  Top 0.61: CRES2B.1 CRES1B.1 | CRES1B.1 7.61,35.4 RFB.6 | CRES1B.1 6.21,34.59 5.4,35.4 4.45,35.4 3.3,36.55 CVB.-
N$8
  Top 0.61: CDIV1B.2 CDIV2B.1 7.69,31.74 RFB.8
N$9
  Top 0.406: RFB.16 17.05,41.74 17.8,41 CDCB.1
N$10
  Top 0.254: MCU.6 54.94,31.34 58.1,28.17 C6.1 58.86,26.82 L6.1
N$11
  Top 0.406: RFB.9 15.14,32.85 16.11,31.89 CDECB.2
N$12
  Top 0.61: 24.31,37.81 CRES1A.1 CRES2A.1 | 24.31,37.81 25.59,39.09 RFA.6 | 24.31,37.81 24.19,37.81 23.6,38.4 21.95,38.4 20.9,39.45 CVA.-
N$13
  Top 0.61: RFA.8 25.69,35.54 CDIV2A.1 CDIV1A.2
N$14
  Top 0.61: CDIV1A.1 CRES2A.2 CRES1A.2 20.1,37.1 19.3,37.9 19.3,45.1 | 19.3,45.1 17.1,47.3 11,47.3 9.23,49.07 JPA.1 | CVA.+ 19.35,45.15 19.3,45.1
N$15
  Top 0.406: 14.04,34.09 RFB.10 15.07,34.12 15.5,33.7 16.41,33.7 CDECB.1
N$16
  Top 0.61: RFB.3 6.61,39.2 CXB.1 RAB.2
N$17
  Top 0.813: Q1.2 12.74,13.09 11.62,11.88 10,11.88 7.88,9.75 7.17,9.75 SW1.P$1
N$18
  Top 0.406: RFA.9 33.46,36.55 CDECA.2
N$19
  Top 0.406: RFA.10 33.86,37.83 CDECA.1
N$20
  Top 0.61: RFA.3 25.7,42.91 24.79,43.81 CXA.1 RAA.2
N$22
  Top 0.61: RAB.1 6.4,50.27 JPB.2
N$35
  Top 0.61: RAA.1 22.35,47.65 21.5,48.5 13.77,48.5 JPA.2
PA00_XIN32
  Top 0.254: MCU.1 53.26,28.83 53.26,25.26 Y4.P$1 53.06,23.69 C9.2
PA01_XOUT32
  Top 0.254: MCU.2 53.76,29.34 54.23,28.87 54.23,27.1 56.16,25.16 Y4.P$2 56.16,23.57 C10.2
PA02_AIN0
  Top 0.254: MCU.3 54.02,29.84 54.74,29.13 54.74,27.48 55.75,26.46 56.9,26.46 57.61,25.75 57.61,24.56 57.99,24.18 59.74,24.18 60.12,23.79 60.12,9.32 55.8,5 53.01,5 51.11,3.1 50.8,3.1
  Top 0.406: VDIV2.1 49.17,6.06 VDIV1.2 49.17,4.42
  Top 0.61: 49.17,4.42 49.48,4.42 50.8,3.1 HDR_AD.1
PA03_AREFA  (via drill 0.6)
  Top 0.254: MCU.4 52.38,30.34 52.07,30.65 52.07,34.34 54.66,36.93 v55.76,36.93
  Top 0.305: v49.2,47.1 49.2,45.01 CREF.+ 49.27,44.74 49.27,43.47 C3.1 49.79,41.41 v50.5,40.7
  Bottom 0.254: 53.79,38 54.86,36.93 v55.76,36.93
  Bottom 0.305: HDR_IOH.8 23.92,50.76 25.76,52.6 39.4,52.6 40.4,51.6 40.4,50 41.6,48.8 47.5,48.8 v49.2,47.1 | 53.79,38 49.2,38 48.3,38.9 48.3,40.1 49.1,40.9 50.3,40.9 v50.5,40.7
PA04_AIN4
  Top 0.254: MCU.9 55.85,32.84 61.64,27.05 61.64,8.44 58.42,5.22 HDR_AD.4
  Top 0.305: HDR_AD.4 58.37,2.59
PA05_AIN5
  Top 0.254: MCU.10 56.18,33.34 62.15,27.28 62.15,3.93 HDR_AD.5
PA6_RFID_SHD  (via drill 0.6)
  Top 0.254: MCU.11 55.26,33.84 | 55.51,34.09 55.75,34.34 | 57.1,45.3 57.1,35.68
  Top 0.305: 57.1,45.3 v56.7,45.7 | 57.1,35.68 v55.9,34.48 55.51,34.09 55.26,33.84
  Top 0.406: RFA.14 30.1,42.9 29.4,42.2 29.4,35.18 v30.56,34.01
  Bottom 0.305: 41.78,50.8 HDR_IOH.1 42.2,50.8 43.7,49.3 49.4,49.3 51.4,47.3 55.1,47.3 v56.7,45.7 | v30.56,34.01 31.55,35 34.9,35 35.9,34 38.1,34 39.3,35.2 52.3,35.2 53.66,33.84 55.3,33.84 55.94,34.48 v55.9,34.48
PA7_RFID_SHD2  (via drill 0.6)
  Top 0.254: MCU.12 53.74,34.34 v54.3,34.9
  Top 0.406: RFB.14 12.79,39.2 12,40 v12,42.9
  Bottom 0.254: v54.3,34.9 52.55,36.65
  Bottom 0.305: 43.15,36.65 52.55,36.65 | 43.15,36.65 42.4,35.9 39,35.9 37.9,34.8 36.2,34.8 35.2,35.8 31,35.8 29.9,36.9 17.9,36.9 v12,42.9 | HDR_IOH.2 39.12,48.72 38.5,48.1 37.4,48.1 36.8,48.7 33.9,48.7 32.8,47.6 32.8,44.3 36.4,40.7 39.8,40.7 43.1,37.4 43.1,36.7 43.15,36.65
PA08_TCC0-W0_PA8  (via drill 0.6)
  Top 0.254: MCU.13 51.87,35.87 54.3,38.3 54.3,45.98 58.42,50.1
  Top 0.305: MEM.4 61.72,40.72 v63.12,42.12 | 58.42,50.1 HDR_IOL.3
  Bottom 0.406: HDR_IOL.3 58.42,50.78 61.2,48 61.2,45.3 63.12,43.38 v63.12,42.12
PA09_TCC0-W1_PA9
  Top 0.254: MCU.14 51.22,36.41 51.44,36.62 51.82,36.62 53.7,38.51 53.7,46.27 55.88,48.45 HDR_IOL.4
PA10_TCC0-W2_PA10
  Top 0.254: MCU.15 50.72,36.67 51.21,37.16 51.59,37.16 53.2,38.77 53.2,46.56 54.61,47.97 54.61,51.44 55.5,52.32 59.44,52.32 HDR_IOL.2
  Bottom 0.305: 60.91,50.74 HDR_IOL.2
PA11_TCC0-W3_PA11
  Top 0.254: MCU.16 50.22,35.04 50.55,34.72 51.69,34.72 54.9,37.93 54.9,45.6 58.59,49.28 61.98,49.28 HDR_IOL.1
  Bottom 0.305: 63.57,50.73 HDR_IOL.1
PA13
  Top 0.254: MCU.22 47.22,35.2 46.86,34.84 46.1,34.84 45.72,35.22 HDR_IOL.8
PA14_TCC0-W4
  Top 0.254: MCU.23 46.72,47.66 47.76,48.7 49.6,48.7 50.2,49.3 51.4,49.3 52.9,50.8 HDR_IOL.5
PA15_TCC0-W5
  Top 0.254: MCU.24 46.2,35.88 46.2,48.1 47.3,49.2 49.1,49.2 50.7,50.8 HDR_IOL.6
PA16_MOSI
  Top 0.305: MCU.25 44.7,48.51 42.93,50.27 42.93,51.69 42.29,52.32 35.56,52.32 HDR_IOH.4
PA17_SCK  (via drill 0.6)
  Top 0.254: MCU.26 44.69,33.83 | 44.68,33.83 MCU.26 | v38.05,49.15 37.85,49.14 43.17,49.14 43.94,48.37 43.94,34.09 44.18,33.84 MCU.26
  Bottom 0.305: v38.05,49.15 37.92,49.28 30.48,49.28 HDR_IOH.6
PA18_SS
  Top 0.254: MCU.27 43.92,33.34 43.43,33.83 43.43,47.99 42.8,48.62 38.98,48.62 38.48,48.12 37.67,48.12 36.58,49.22 HDR_IOH.3
  Bottom 0.254: 36.53,50.75 HDR_IOH.3
PA19_MISO
  Top 0.254: HDR_IOH.5 32,50.79 33.51,49.28 35.84,49.28 37.45,47.67 38.77,47.67 39.23,48.12 42.42,48.12 42.92,47.62 42.92,33.58 43.66,32.84 MCU.28
PA20_TCC0-W6
  Top 0.254: MCU.29 44.71,32.33 45.44,32.33 45.72,32.61 45.72,34.46 45.21,34.97 45.21,48.75 44.45,49.51 44.45,51.56 45.21,52.32 46.74,52.32 HDR_IOL.7
PA21_INT&SDCS  (via drill 0.6)
  Top 0.254: MCU.30 43.9,31.84 42.41,33.32 42.41,36.59 v41.9,37.1 | RTC.P$3 38.9,44.6 40.28,43.22 RP_INT.1
  Top 0.406: v39.8,38.9 40.2,39.3 RP_INT.1
  Bottom 0.406: 26.28,38.05 SD.1 28.45,38.05 30.4,40 38.7,40 v39.8,38.9 41.6,37.1 v41.9,37.1
PA22_SDA  (via drill 0.6)
  Top 0.254: 25.95,49.38 32.65,49.38 33.25,48.77 35.63,48.77 37.4,47 37.7,47 RTC.P$5 39.1,46.2 42.2,43.1 42.2,38.9 40.9,37.6 40.9,36.7 41.9,35.7 41.9,33.08 43.63,31.34 MCU.31 45.36,31.34 46,30.7 v46,30 | v41.2,31.5 40.98,31.28 RP_SDA.1
  Top 0.305: 25.95,49.38 25.1,50.23 25.1,51.6 24.4,52.3 22.84,52.3 HDR_IOH.9
  Bottom 0.254: v46,30 44.5,31.5 v41.2,31.5
PA23_SCL
  Top 0.254: HDR_IOH.10 19.15,50.8 20.66,49.3 25.16,49.3 25.7,48.76 32.49,48.76 33,48.25 35.45,48.25 37.7,46 37.7,45.8 38.1,45.4 RTC.P$4 39,45.4 41.6,42.8 41.6,39.1 40.4,37.9 40.4,36.4 41.4,35.4 41.4,34.95 RP_SCL.1 41.4,33.75 41.4,32.9 43.36,30.84 MCU.32
PA27_TX_LED
  Top 0.305: MCU.39 47.22,24.62 46.6,24 40,24 33.65,17.64 R1.2
PA28_2FETS  (via drill 0.6)
  Top 0.305: MCU.41 48.22,23.37 47.15,22.3 v45.8,22.3
  Top 0.406: R3.1 v40.19,22.26 v40.19,22.27
  Top 0.61: v34.7,27 34.7,27.9 34.69,28.59 T_SD.1
  Bottom 0.305: v34.7,27 39.44,22.27 v40.19,22.27 41.03,22.27 41.4,21.9 45.4,21.9 v45.8,22.3
PA30_SWCLK  (via drill 0.6)
  Top 0.254: MCU.45 50.22,20.95
  Top 0.305: 50.22,20.95 51.44,19.73 v51.44,18.93
  Bottom 0.305: ICSP10.4 66.26,19.27 66.67,19.68 66.67,21.34 65.63,22.38 61.38,22.38 57.5,18.5 56.3,18.5 56,18.8 51.56,18.8 v51.44,18.93
PA31_SWDIO  (via drill 0.6)
  Top 0.254: MCU.46 50.72,21.97 v55.03,17.66
  Bottom 0.305: ICSP10.2 65.53,20.95 64.77,21.72 61.98,21.72 57.93,17.66 v55.03,17.66
PB02  (via drill 0.6)
  Top 0.254: MCU.47 51.22,22.48 54.05,19.66 v56.95,19.66 | v63.16,23.5 62.66,23.29 62.66,3.68 HDR_AD.6
  Bottom 0.305: v56.95,19.66 57.16,19.66 60.99,23.5 v63.16,23.5
PB03_RFIDIN  (via drill 0.6)
  Top 0.305: MCU.48 51.72,29.99 50.95,30.75 v50.95,30.96
  Top 0.406: RFA.13 30.54,41.63 30.2,41.3 30.3,35.6 30.6,35.3 31.6,35.3 33.2,33.7 v33.2,33.4 | RFB.13 12.73,37.94 12.3,37.5 12.3,32.3 13.07,31.52 v14.43,31.52
  Bottom 0.406: v50.95,30.96 48.29,30.96 45.25,34 39.9,34 38.6,32.7 34.5,32.7 33.8,33.4 v33.2,33.4 32,32.2 29.1,32.2 28.7,31.8 24,31.8 21.9,29.7 17.5,29.7 15.68,31.52 v14.43,31.52
PB08_AIN2
  Top 0.254: MCU.7 55.33,31.84 60.62,26.54 60.62,9.03 55.9,4.3 55.1,4.3 HDR_AD.2
  Top 0.305: HDR_AD.2 53.37,2.56
PB09_AIN3
  Top 0.254: MCU.8 55.59,32.34 61.13,26.8 61.13,8.73 55.88,3.48 HDR_AD.3
PB10_S4_SPI_MOSI  (via drill 0.6)
  Top 0.305: v47.12,33.83 47.62,33.83 48.72,34.92 MCU.19 | MEM.1 57.91,35.17 v57.89,35.15
  Bottom 0.305: 46.99,33.83 v47.12,33.83 | ICSP6.4 66.17,28.53 64.9,29.8 64.9,31.74 63.74,32.9 57.9,32.9 | 57.9,32.9 52.2,32.9 51.3,33.8 47.29,33.8 v47.12,33.83 | v57.89,35.15 57.89,32.91 57.9,32.9 | v47.12,33.83 46.34,34.6 39.6,34.6 38.4,33.4 35.4,33.4 34.4,34.4 32.5,34.4 31.1,33 30,33 27.45,35.55 SD.2
PB11_S4_SPI_SCK  (via drill 0.6)
  Top 0.254: MCU.20 48.22,38.54 v49.31,39.63
  Top 0.305: ICSP6.3 62.46,27.94 59.18,31.22 MEM.2 59.18,38.62 58.16,39.64 v58.16,40.83
  Bottom 0.305: ICSP6.3 57.16,21.48 56,21.48 54.75,20.23 53.5,20.23 52.52,21.2 33.9,21.2 27.35,27.75 SD.5 | v49.31,39.63 51.03,39.63 51.83,40.43 57.76,40.43 v58.16,40.83
PB12_S4_SPI_MISO  (via drill 0.6)
  Top 0.254: MCU.21 47.72,36.52 47.28,36.96 47.28,47.19 | MEM.8 v57.91,46.61
  Top 0.305: v62.22,34.1 63.75,32.57 63.75,30.6 ICSP6.1 | 47.28,47.19 48.19,48.1 51.86,48.1 v52.16,48.4
  Bottom 0.305: ICSP6.1 63.63,30.23 64.9,28.96 64.9,27.3 64.26,26.67 63.17,26.67 57.3,20.8 56.2,20.8 55,19.6 53.12,19.6 52.12,20.6 32.5,20.6 30.05,23.05 SD.7 | v52.16,48.4 56.22,48.4 v57.91,46.61 60.87,43.65 60.87,35.45 v62.22,34.1
PB22_DEBUG_TX
  Top 0.305: MCU.37 46.22,26.92 46,26.7 45.2,26.7 TP2.TP
PB23_DEBUG_RX
  Top 0.305: MCU.38 46.72,26.02 TP1.TP
RESET  (via drill 0.6)
  Top 0.406: HDR_POWER.3 33.02,3.38 | R2.2 42.14,19.21 v42.14,17.65 41.34,16.85 28.65,16.85 25.31,13.51 R4.1
  Top 0.61: R4.1 25.18,12.53 D1.A 27.19,9.21 RESET.3 33.02,9.21 | HDR_POWER.3 33.02,9.21 | RESET.4 33.02,9.21
  Bottom 0.406: ICSP6.5 63.75,25.27 63.75,24.64 64.52,23.88 65.15,23.88 67.31,21.69 67.31,16.13 66.64,15.46 ICSP10.10 65.53,14.72 65.16,14.35 52.75,14.35 49.45,17.65 v42.14,17.65
SW
  Top 0.61: VREG.5 46.5,13.35 L1.P$1
TARGET_RESET
  Top 0.305: R2.1 C8.1 44.45,23.15 44.7,23.4 46.9,23.4 47.72,24.22 MCU.40
TARGET_USB_N
  Top 0.254: 44.29,30.34 MCU.33 41.64,30.34 35.9,24.6 18.4,24.6 | USB.D- 8.84,24.6 18.4,24.6 | Z6.2 18.4,25.68 18.4,24.6
TARGET_USB_P
  Top 0.254: MCU.34 MCU.34 arc90 MCU.34 | USB.D+ 8.87,23.9 13.6,23.9 | 13.56,23.86 13.6,23.9 | 13.6,23.9 15.6,23.9 | 15.6,23.9 36.2,23.9 42.14,29.84 MCU.34 | Z5.2 15.6,22.48 15.6,23.9
V_IN  (via drill 0.6)
  Top 0.406: 26.43,41.6 RFA.4 | CBLKB.1 18.4,31.2 19.4,30.2
  Top 0.61: 10.6,34.2 10.6,32.5 13.9,29.2 15.5,29.2 v15.9,28.8 17.9,28.8 19.3,30.2 19.4,30.2 26.9,30.2 28.5,31.8 | 10.6,34.2 10.6,37.94 | 10.6,37.94 RFB.4 6.55,37.94 CXB.2 | 39.95,14.3 C5V.1 | 26.43,41.6 28.5,41.6 28.5,37.9 | 28.5,37.9 28.5,31.8 | 30.7,31.8 33.6,31.8 34.7,32.9 34.7,34.8 35.3,35.4 35.3,36.5 | 30.7,31.8 28.5,31.8 | CE3.+ 30.7,31.8 | 35.3,36.5 arc-90 35.38,36.58 CE2.+ | v63.88,12.57 64.64,12.57 67.31,15.24 67.31,24.13 67.82,24.64 67.82,28.83 ICSP6.2 | 38.1,2.92 38.1,3.2 40.6,5.7 44.4,5.7 | 44.4,5.7 46,7.3 47.3,7.3 | 47.3,7.3 52.77,7.3 v58.04,12.57 | HDR_POWER.8 45.72,4.38 44.4,5.7 | VDIV2.2 47.36,7.24 47.3,7.3 | 13.6,45.8 CE1.+ 13,45.8 10.6,43.4 10.6,37.94 | RFB.7 10.53,34.12 10.6,34.2 | RFA.7 28.43,37.83 28.5,37.9 | RFA.4 24.95,41.63 CXA.2 | 35.3,36.5 35.3,38.09 CBLKA.1 | VREG.1 38.4,13.35 38.4,13.4 | VREG.3 38.4,11.45 38.4,11.5
  Top 0.813: C5V.1 39,15 38.4,14.4 38.4,13.4 38.4,11.5 v38.4,8.6 | HDR_POWER.5 38.1,2.92
  Bottom 0.61: v58.04,12.57 v63.88,12.57
  Bottom 0.813: SW1.P$3 12.61,11.19 15.9,11.19 | 15.9,11.19 v15.9,28.8 | 15.9,11.19 20.51,11.19 23.1,8.6 v38.4,8.6 40.2,8.6 45.72,3.08 HDR_POWER.8
VBAT1  (via drill 0.6)  (1 unrouted)
  Top 0.406: RTC.P$7 35,45.4 v34.9,45.5
  Bottom 0.406: BAT.+@1 37.05,43.35 v34.9,45.5
VDD  (via drill 0.6)
  Top 0.61: T_SD.3 34.73,31.23 33.89,30.39 v32.88,30.39
  Bottom 0.61: SD.4 29.65,30.55 30.1,31 32.26,31 v32.88,30.39
VDDCORE
  Top 0.254: MCU.43 49.22,22.59 47.37,20.74 C11.1
XUSB  (via drill 0.6)
  Top 0.305: v11.6,25.74 11.97,25.69
  Top 0.406: 12.02,25.77 13.11,25.77 C7.1 | USB.VBUS 9.84,25.44 10,25.6
  Top 0.508: 12.02,25.77 v11.6,25.74
  Top 0.813: SW1.P$5 14.4,18.43 v13,19.82 | 10,25.6 11.46,25.6 v11.6,25.74
  Bottom 0.813: v13,19.82 13,24.25 v11.6,25.74

### Text on the board
tPlace: IOREF / 3.3V | RESET | 3.3V | V IN / 5V | V IN / 5V | GND | GND | ADC / A0 | A1 | A2 | A3 | A4 | A5
tNames: SCL | SDA | AREF | GND | 12 | 7 | 6 | 5 | 4 | 3 | 2 | 13 | 11 | 10 | 9 | 8 | TX / 1 | RX / 0 | ANT / 2 | ANT / 1 | 1 | +A | -K | 1 | 1 | 1 | RFID Arduino / University of Oklahoma / March 2018 | Pin 1 | + | + | - | - | L1 / 2.2uH | ON USB-> | <-ON BATTERY
214bmp: D:/SmartProjects/Snc/a4_bn_logo2.bmp